# EAGLE design USB to Serial (EAGLE 7.4.0)
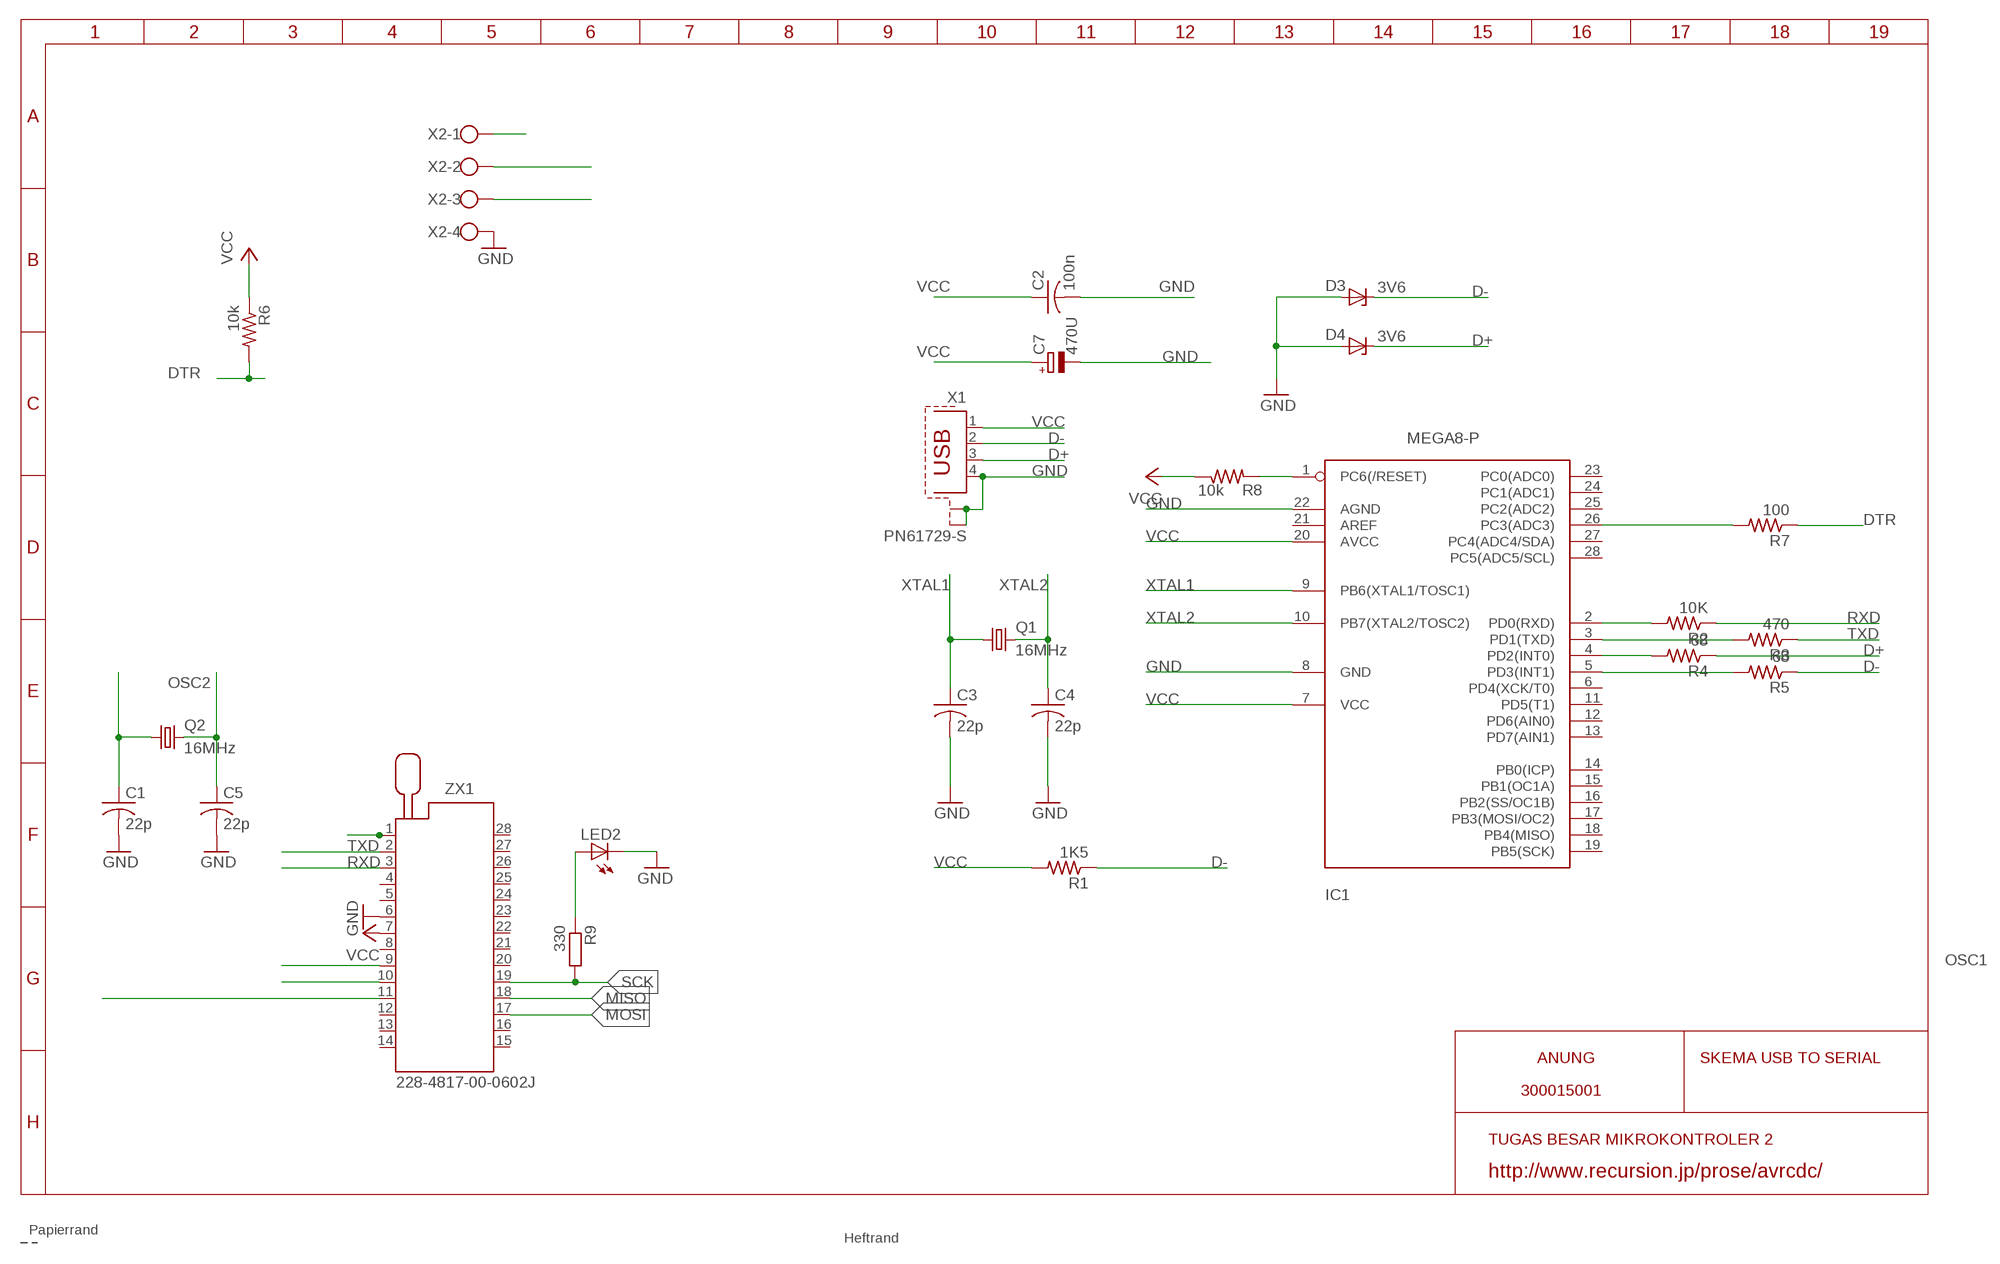
[diagram p0: schematic, sheet 1, part 1 of 2]
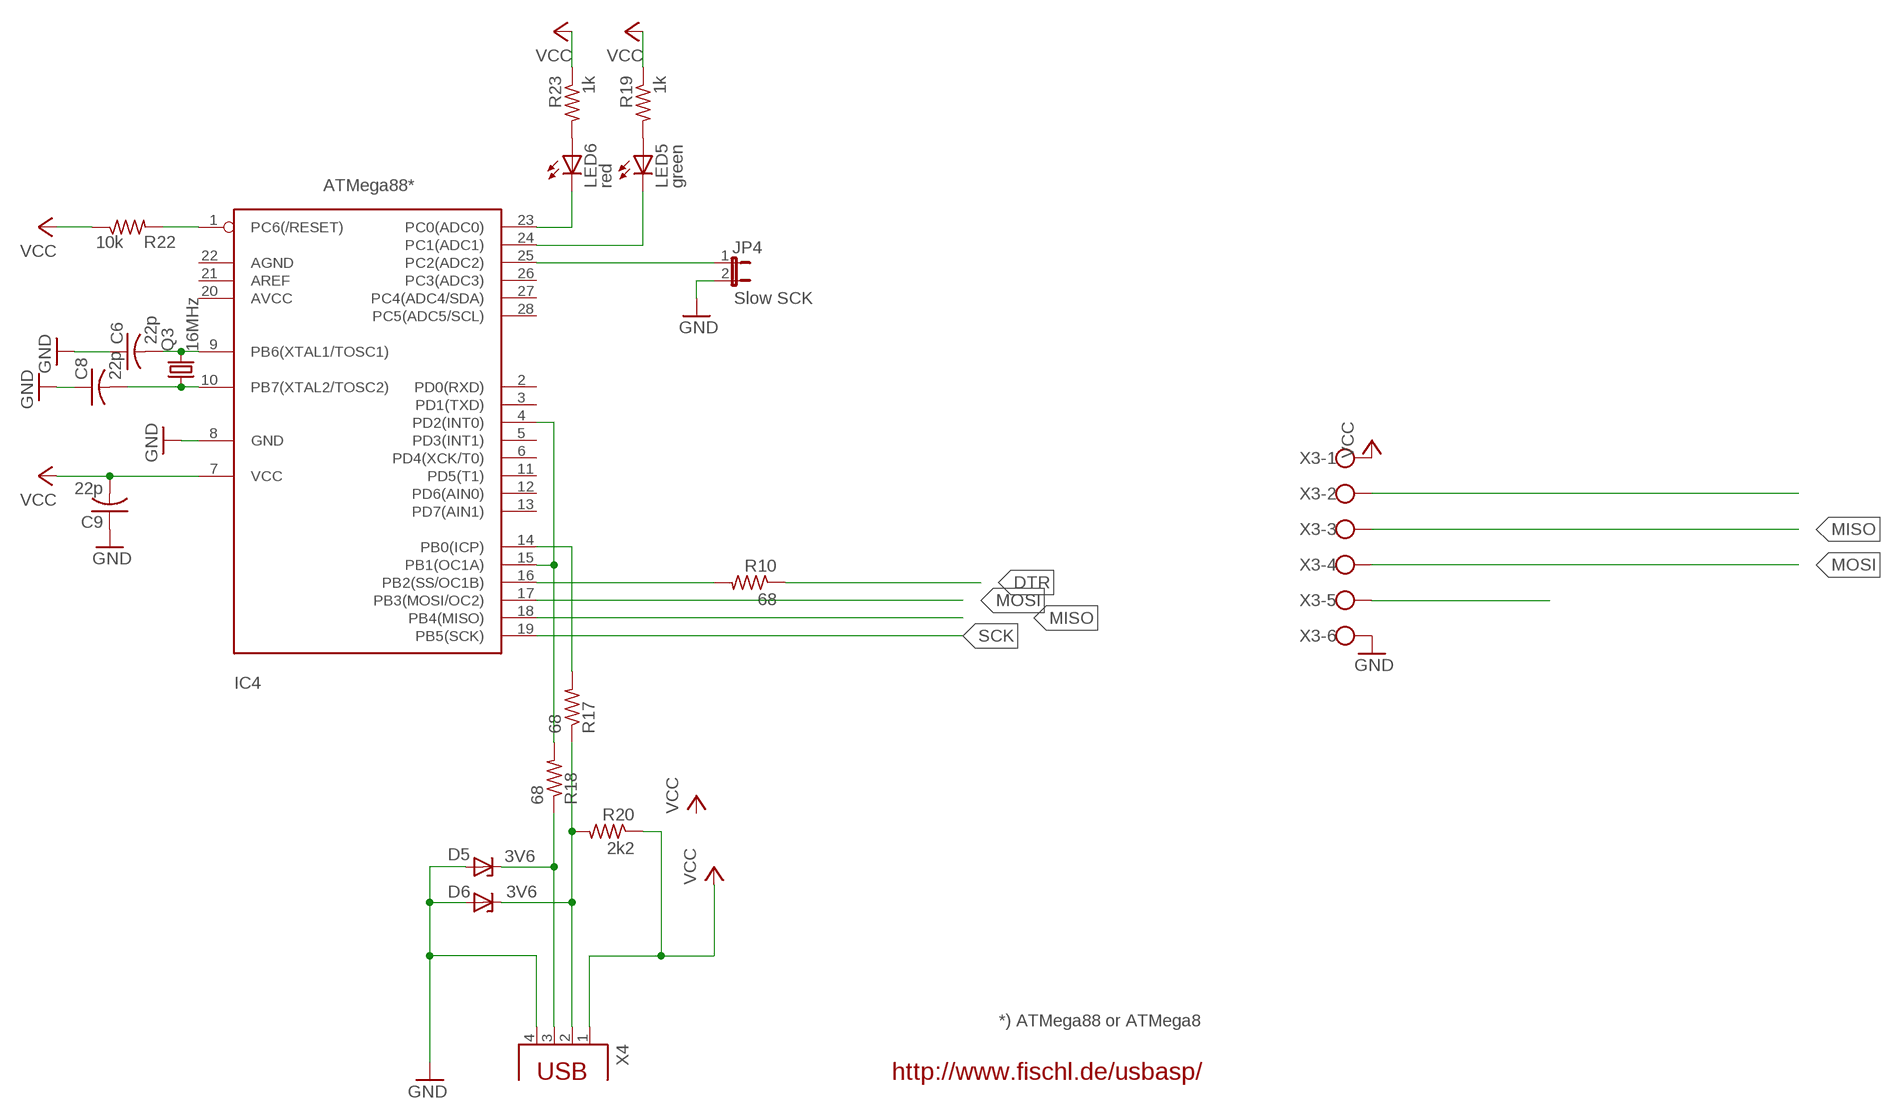
[diagram p1: schematic, sheet 1, part 2 of 2]

## Parts
C1  22p  C-US050-024X044  [C050-024X044]
C2  100n  C-US050-024X044  [C050-024X044]
C3  22p  C-US050-024X044  [C050-024X044]
C4  22p  C-US050-024X044  [C050-024X044]
C5  22p  C-US050-024X044  [C050-024X044]
C6  22p  C-US050-024X044  [C050-024X044]
C7  470U  CPOL-EUE5-5  [E5-5]
C8  22p  C-US050-024X044  [C050-024X044]
C9  22p  C-US050-024X044  [C050-024X044]
D3  3V6  ZENER-DIODEDO34-7  [DO34Z7]
D4  3V6  ZENER-DIODEDO34-7  [DO34Z7]
D5  3V6  ZENER-DIODEDO34-7  [DO34Z7]
D6  3V6  ZENER-DIODEDO34-7  [DO34Z7]
IC1  MEGA8-P  [DIL28-3]
IC4  ATMega88*  MEGA8-P  [DIL28-3]
JP4  Slow SCK  JP1E  [JP1]
LED2  LED5MM  [LED5MM]
LED5  green  LED5MM  [LED5MM]
LED6  red  LED5MM  [LED5MM]
Q1  16MHz  CRYSTALHC49S  [HC49/S]
Q2  16MHz  CRYSTALHC49S  [HC49/S]
Q3  16MHz  CRYSTALHC49S  [HC49/S]
R1  1K5  R-US_0207/7  [0207/7]
R2  10K  R-US_0207/7  [0207/7]
R3  470  R-US_0207/7  [0207/7]
R4  68  R-US_0207/7  [0207/7]
R5  68  R-US_0207/7  [0207/7]
R6  10k  R-US_0207/7  [0207/7]
R7  100  R-US_0207/7  [0207/7]
R8  10k  R-US_0207/10  [0207/10]
R9  330  R-EU_0207/10  [0207/10]
R10  68  R-US_0207/10  [0207/10]
R17  68  R-US_0207/10  [0207/10]
R18  68  R-US_0207/10  [0207/10]
R19  1k  R-US_0207/10  [0207/10]
R20  2k2  R-US_0207/10  [0207/10]
R22  10k  R-US_0207/10  [0207/10]
R23  1k  R-US_0207/10  [0207/10]
X1  PN61729-S  [PN61729-S]
X2  W237-4  [W237-4]
X3  W237-6  [W237-6]
X4  PN61729  [PN61729]
ZX1  228-4817-00-0602J  [228-4817-00-0602J]

## Nets
D+: D4.C R4.1 X1.3
D-: D3.C R1.1 R5.1 X1.2
DTR: R6.2 R7.1 R10.1 X2.1 ZX1.1
GND: C1.2 C2.2 C3.2 C4.2 C5.2 C6.1 C7.- C8.1 C9.1 D3.A D4.A D5.A D6.A IC1.8(GND) IC1.22(AGND) IC4.8(GND) JP4.2 LED2.K(C) X1.4 X1.S1 X1.S2 X2.4 X3.6 X4.4 ZX1.6
MISO: IC4.18(PB4(MISO)) X3.3 ZX1.18
MOSI: IC4.17(PB3(MOSI/OC2)) X3.4 ZX1.17
N$1: IC4.16(PB2(SS/OC1B)) R10.2 X3.5
N$2: IC1.2(PD0(RXD)) R2.2
N$3: IC1.3(PD1(TXD)) R3.2
N$4: IC1.1(PC6(/RESET)) R8.2
N$6: IC1.4(PD2(INT0)) R4.2
N$7: IC1.5(PD3(INT1)) R5.2
N$9: ZX1.11
N$11: IC1.26(PC3(ADC3)) R7.2
N$16: LED2.A R9.1
N$33: D6.C R17.1 R20.2 X4.2
N$34: D5.C R18.1 X4.3
N$35: C6.2 IC4.9(PB6(XTAL1/TOSC1)) Q3.2
N$36: C8.2 IC4.10(PB7(XTAL2/TOSC2)) Q3.1
N$37: LED5.A R19.2
N$38: IC4.4(PD2(INT0)) IC4.15(PB1(OC1A)) R18.2
N$39: IC4.1(PC6(/RESET)) R22.2
N$47: IC4.25(PC2(ADC2)) JP4.1
N$48: LED6.A R23.2
N$49: IC4.23(PC0(ADC0)) LED6.K(C)
N$50: IC4.24(PC1(ADC1)) LED5.K(C)
N$51: IC4.14(PB0(ICP)) R17.2
OSC1: C1.1 Q2.1 ZX1.9
OSC2: C5.1 Q2.2 ZX1.10
RXD: R2.1 X2.3 ZX1.3
SCK: IC4.19(PB5(SCK)) R9.2 X3.2 ZX1.19
TXD: R3.1 X2.2 ZX1.2
VCC: C2.1 C7.+ C9.2 IC1.7(VCC) IC1.20(AVCC) IC4.7(VCC) R1.2 R6.1 R8.1 R19.1 R20.1 R22.1 R23.1 X1.1 X3.1 X4.1 ZX1.7
XTAL1: C3.1 IC1.9(PB6(XTAL1/TOSC1)) Q1.1
XTAL2: C4.1 IC1.10(PB7(XTAL2/TOSC2)) Q1.2
Unconnected: IC1.6(PD4(XCK/T0)) IC1.11(PD5(T1)) IC1.12(PD6(AIN0)) IC1.13(PD7(AIN1)) IC1.14(PB0(ICP)) IC1.15(PB1(OC1A)) IC1.16(PB2(SS/OC1B)) IC1.17(PB3(MOSI/OC2)) IC1.18(PB4(MISO)) IC1.19(PB5(SCK)) IC1.21(AREF) IC1.23(PC0(ADC0)) IC1.24(PC1(ADC1)) IC1.25(PC2(ADC2)) IC1.27(PC4(ADC4/SDA)) IC1.28(PC5(ADC5/SCL)) IC4.2(PD0(RXD)) IC4.3(PD1(TXD)) IC4.5(PD3(INT1)) IC4.6(PD4(XCK/T0)) IC4.11(PD5(T1)) IC4.12(PD6(AIN0)) IC4.13(PD7(AIN1)) IC4.20(AVCC) IC4.21(AREF) IC4.22(AGND) IC4.26(PC3(ADC3)) IC4.27(PC4(ADC4/SDA)) IC4.28(PC5(ADC5/SCL)) ZX1.4 ZX1.5 ZX1.8 ZX1.12 ZX1.13 ZX1.14 ZX1.15 ZX1.16 ZX1.20 ZX1.21 ZX1.22 ZX1.23 ZX1.24 ZX1.25 ZX1.26 ZX1.27 ZX1.28

## Notes on the sheet
- *) ATMega88 or ATMega8
- ANUNG | SKEMA USB TO SERIAL
- 300015001 | http://www.fischl.de/usbasp/
- TUGAS BESAR MIKROKONTROLER 2
- http://www.recursion.jp/prose/avrcdc/

## Library data of the parts
C1-C6 C8 C9 = adafruit:C-US: CAPACITOR, American symbol
C7 = rcl:CPOL-EU: POLARIZED CAPACITOR, European symbol
D3-D6 = diode:ZENER-DIODE: Z-Diode
IC1 IC4 = atmel:MEGA8-P: MICROCONTROLLER 8 Kbytes FLASH 1 kbytes SRAM 512 bytes EEPROM USART 4-channel 10 bit ADC 2-channel 8 bit ADC Source: avr.lbr
JP4 = jumper:JP1E: JUMPER
LED2 LED5 LED6 = led:LED: LED OSRAM: - CHIPLED LG R971, LG N971, LY N971, LG Q971, LY Q971, LO R971, LY R971 LH N974, LH R974 LS Q976, LO Q976, LY Q976 LO Q996 - Hyper CHIPLED LW Q18S LB Q993, LB Q99A, LB R99A - SideLED LS A670, LO A670, LY A670, LG A670, LP A670 LB A673, LV A673, LT A673, LW A673 LH A674 LY A675 LS A676, LA A676, LO A676, LY A676, LW A676 LS A679, LY A679, LG A679 - Hyper Micro SIDELED® LS Y876, LA Y876, LO Y876, LY Y876 LT Y87S - SmartLED LW L88C, LW L88S LB L89C, LB L89S, LG L890 LS L89K, LO L89K, LY L89K LS L896, LA L896, LO L896, LY L896 - TOPLED LS T670, LO T670, LY T670, LG T670, LP T670 LSG T670, LSP T670, LSY T670, LOP T670, LYG T670 LG T671, LOG T671, LSG T671 LB T673, LV T673, LT T673, LW T673 LH T674 LS T676, LA T676, LO T676, LY T676, LB T676, LH T676, LSB T676, LW T676 LB T67C, LV T67C, LT T67C, LS T67K, LO T67K, LY T67K, LW E67C LS E67B, LA E67B, LO E67B, LY E67B, LB E67C, LV E67C, LT E67C LW T67C LS T679, LY T679, LG T679 LS T770, LO T770, LY T770, LG T770, LP T770 LB T773, LV T773, LT T773, LW T773 LH T774 LS E675, LA E675, LY E675, LS T675 LS T776, LA T776, LO T776, LY T776, LB T776 LHGB T686 LT T68C, LB T68C - Hyper Mini TOPLED® LB M676 - Mini TOPLED Santana® LG M470 LS M47K, LO M47K, LY M47K Source: http://www.osram.convergy.de LUXEON: - LUMILED® LXK2-PW12-R00, LXK2-PW12-S00, LXK2-PW14-U00, LXK2-PW14-V00 LXK2-PM12-R00, LXK2-PM12-S00, LXK2-PM14-U00 LXK2-PE12-Q00, LXK2-PE12-R00, LXK2-PE12-S00, LXK2-PE14-T00, LXK2-PE14-U00 LXK2-PB12-K00, LXK2-PB12-L00, LXK2-PB12-M00, LXK2-PB14-N00, LXK2-PB14-P00, LXK2-PB14-Q00 LXK2-PR12-L00, LXK2-PR12-M00, LXK2-PR14-Q00, LXK2-PR14-R00 LXK2-PD12-Q00, LXK2-PD12-R00, LXK2-PD12-S00 LXK2-PH12-R00, LXK2-PH12-S00 LXK2-PL12-P00, LXK2-PL12-Q00, LXK2-PL12-R00 Source: www.luxeon.com KINGBRIGHT: KA-3528ASYC Source: www.kingbright.com
Q1-Q3 = adafruit:CRYSTAL: CRYSTAL; OC_FARNELL: 1667008; OC_NEWARK: unknown
R1-R7 = adafruit:R-US_: RESISTOR, American symbol
R8 R10 R17-R20 R22 R23 = rcl:R-US_: RESISTOR, American symbol
R9 = rcl:R-EU_: RESISTOR, European symbol
X1 = con-berg:PN61729-S: BERG USB connector; OC_FARNELL: unknown; OC_NEWARK: unknown
X2 = con-wago-500:W237-4: WAGO SCREW CLAMP; OC_FARNELL: unknown; OC_NEWARK: unknown
X3 = con-wago-500:W237-6: WAGO SCREW CLAMP; OC_FARNELL: unknown; OC_NEWARK: unknown
X4 = con-berg:PN61729: BERG USB connector
ZX1 = con-3m:228-?00-0602J: Zero Insertion Force Socked Source: http://www.3M.com/ehpd; MF: 3M; MPN: 228-4817-00-0602J; OC_FARNELL: 1252775; OC_NEWARK: 85K7834

## Board
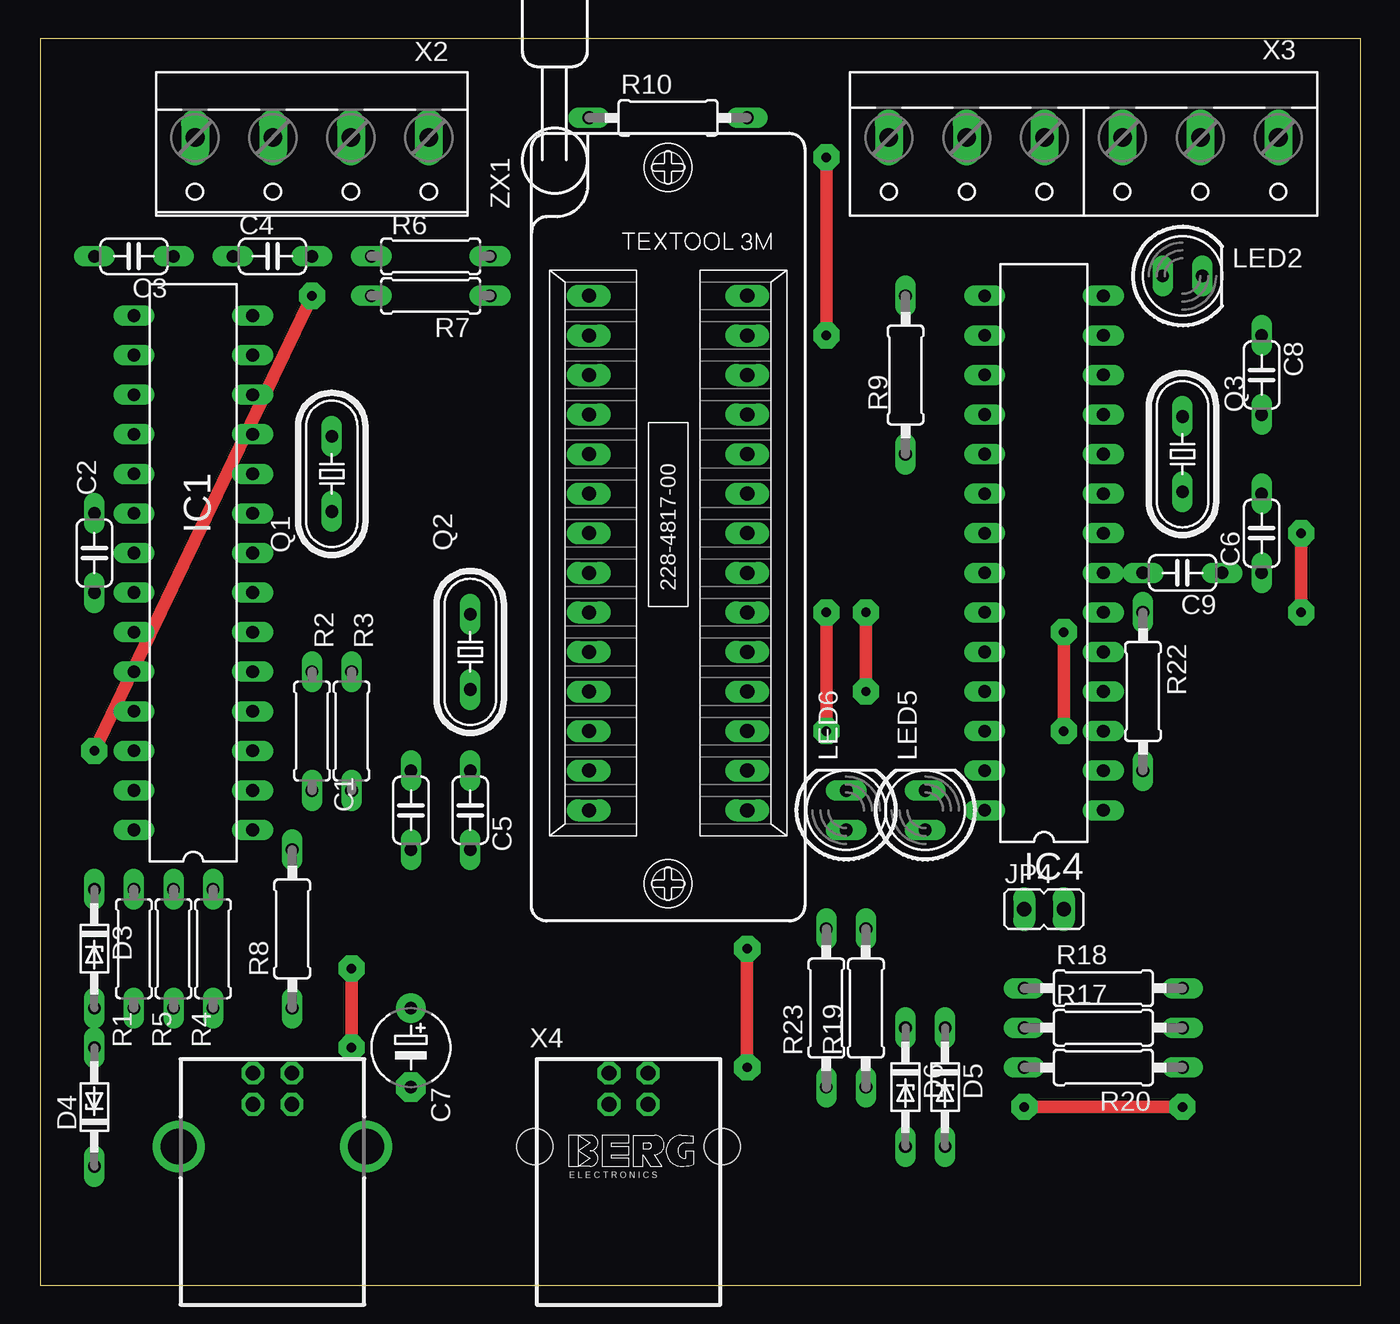
[diagram p2: board, top side]
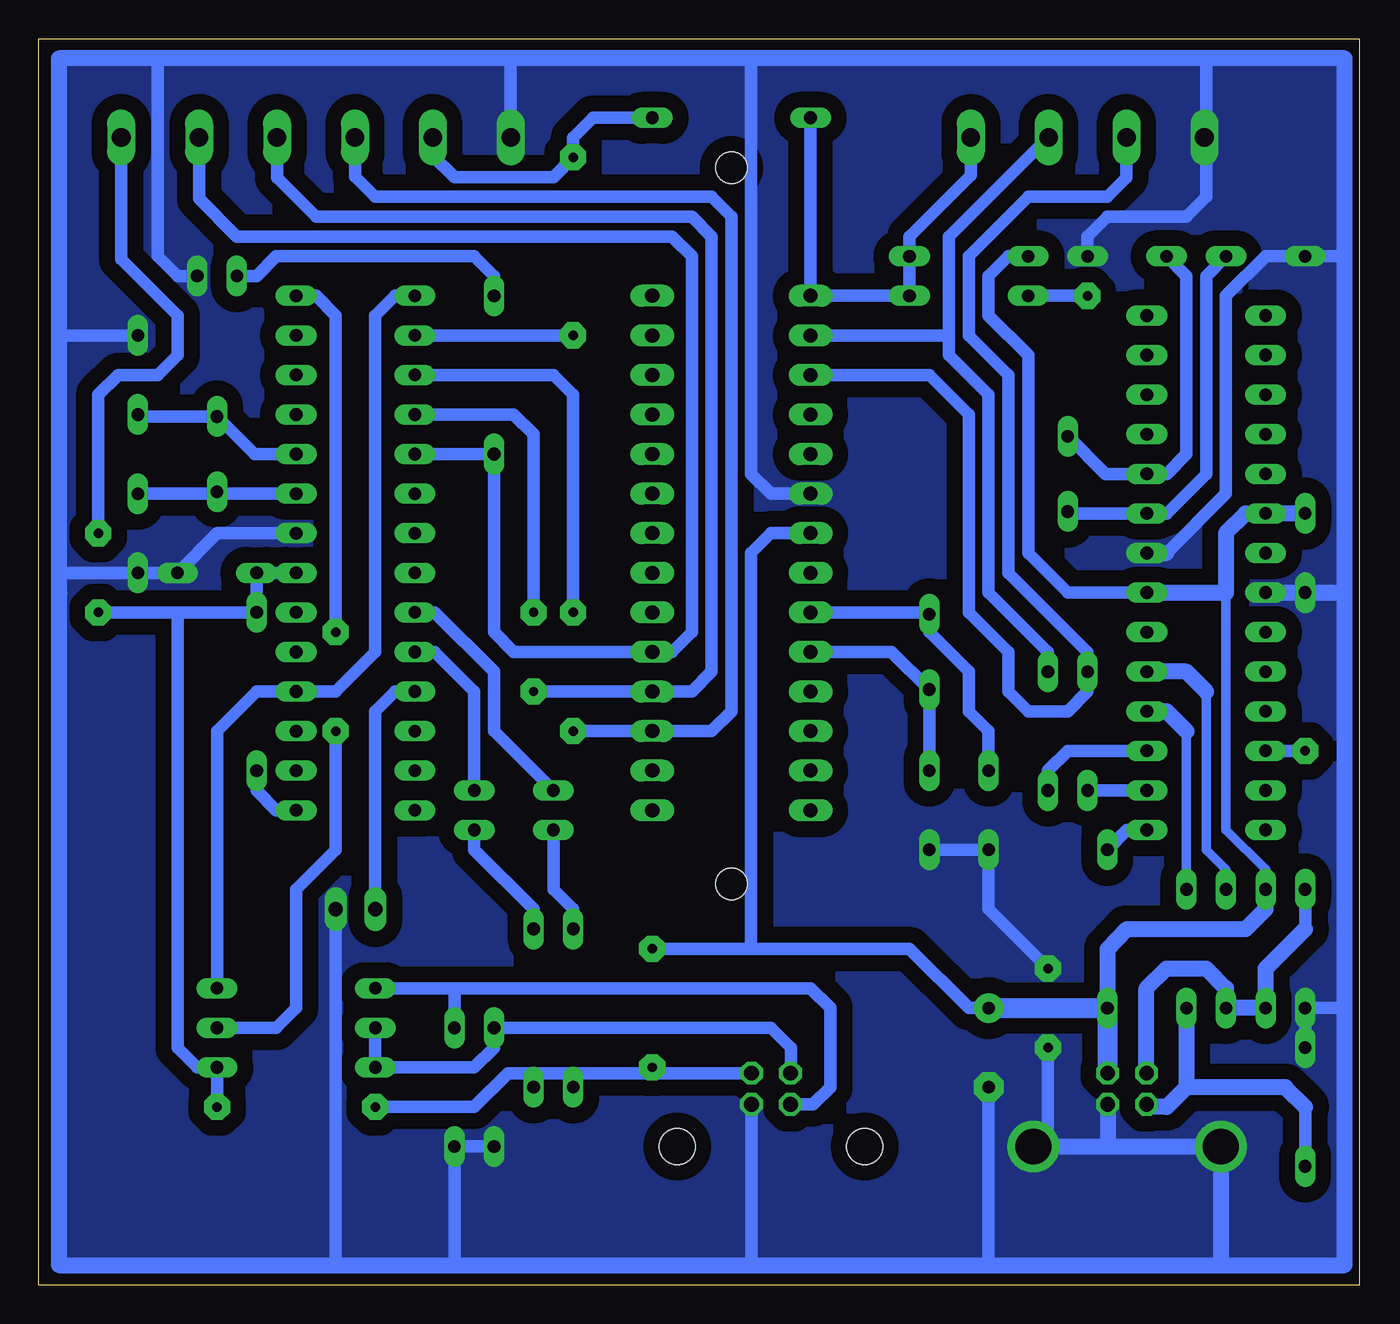
[diagram p3: board, bottom side, seen from below]

Size 84.76 x 79.99 mm. Coordinates in mm from the lower left corner, seen from the top.
Outline: 84.76,0 84.76,79.99 0,79.99 0,0 84.76,0
Copper layers (1*16): Top 0.035mm / dielectric 1.5mm / Bottom 0.035mm
Design rules "default": minimum track width 10mil, minimum drill 24mil, track to track 8mil, track to pad 8mil, pad to pad 8mil, via to via 8mil, smd to smd 8mil, copper to edge 40mil, drill to drill 8mil, minimum pad ring 10mil, minimum via ring 8mil, stop-mask expansion 4mil, vias tented up to drill 0mil, thermal gap 10mil

### Footprints (pad centres in the part's own frame; a part is rotated, then mirrored left to right if it is on the bottom)
C050-024X044 = drill 0.813 long: 1 -2.54,0; 2 2.54,0
E5-5 = drill 0.813 pad 1.905: + -2.54,0 | drill 0.813 pad 1.905 octagon: - 2.54,0
DO34Z7 = drill 0.813 long: A 3.81,0; C -3.81,0
DIL28-3 = drill 0.813 long: 1 -16.51,-3.81; 2 -13.97,-3.81; 3 -11.43,-3.81; 4 -8.89,-3.81; 5 -6.35,-3.81; 6 -3.81,-3.81; 7 -1.27,-3.81; 8 1.27,-3.81; 9 3.81,-3.81; 10 6.35,-3.81; 11 8.89,-3.81; 12 11.43,-3.81; 13 13.97,-3.81; 14 16.51,-3.81; 15 16.51,3.81; 16 13.97,3.81; 17 11.43,3.81; 18 8.89,3.81; 19 6.35,3.81; 20 3.81,3.81; 21 1.27,3.81; 22 -1.27,3.81; 23 -3.81,3.81; 24 -6.35,3.81; 25 -8.89,3.81; 26 -11.43,3.81; 27 -13.97,3.81; 28 -16.51,3.81
JP1 = drill 0.914 long: 1 0,-1.27; 2 0,1.27
LED5MM = drill 0.813 long: A -1.27,0; K 1.27,0
HC49/S = drill 0.813 long: 1 -2.413,0; 2 2.413,0
0207/7 = drill 0.813 long: 1 -3.81,0; 2 3.81,0
0207/10 = drill 0.813 long: 1 -5.08,0; 2 5.08,0
PN61729-S = drill 0.95 octagon: 1 1.25,4.71; 2 -1.25,4.71; 3 -1.25,2.71; 4 1.25,2.71 | drill 2.3 pad 2.9: S1 -6.02,0; S2 6.02,0
W237-4 = drill 1.194 long: 1 -7.5,-1.27; 2 -2.5,-1.27; 3 2.5,-1.27; 4 7.5,-1.27
W237-6 = drill 1.194 long: 1 -12.5,-1.27; 2 -7.5,-1.27; 3 -2.5,-1.27; 4 2.5,-1.27; 5 7.5,-1.27; 6 12.5,-1.27
PN61729 = drill 0.95 octagon: 1 1.25,4.71; 2 -1.25,4.71; 3 -1.25,2.71; 4 1.25,2.71 | hole 2.3: -6.02,0; 6.02,0
228-4817-00-0602J = drill 0.9 long: 1 -16.51,-5.08; 2 -13.97,-5.08; 3 -11.43,-5.08; 4 -8.89,-5.08; 5 -6.35,-5.08; 6 -3.81,-5.08; 7 -1.27,-5.08; 8 1.27,-5.08; 9 3.81,-5.08; 10 6.35,-5.08; 11 8.89,-5.08; 12 11.43,-5.08; 13 13.97,-5.08; 14 16.51,-5.08; 15 16.51,5.08; 16 13.97,5.08; 17 11.43,5.08; 18 8.89,5.08; 19 6.35,5.08; 20 3.81,5.08; 21 1.27,5.08; 22 -1.27,5.08; 23 -3.81,5.08; 24 -6.35,5.08; 25 -8.89,5.08; 26 -11.43,5.08; 27 -13.97,5.08; 28 -16.51,5.08 | hole 2: 21.24,0; -24.74,0

### Placement (x,y rotation side)
C1  23.8,30.48 270 top
C2  3.48,46.99 270 top
C3  6.02,66.04 180 top
C4  14.91,66.04 0 top
C5  27.61,30.48 270 top
C6  78.41,48.26 90 top
C7  23.8,15.24 270 top
C8  78.41,58.42 270 top
C9  73.33,45.72 180 top
D3  3.48,21.59 270 top
D4  3.48,11.43 90 top
D5  58.09,12.7 270 top
D6  55.55,12.7 270 top
IC1  9.83,45.72 90 top
IC4  64.44,46.99 90 top
JP4  64.44,24.13 270 top
LED2  73.33,64.77 0 top
LED5  56.82,30.48 90 top
LED6  51.74,30.48 90 top
Q1  18.72,52.07 90 top
Q2  27.61,40.64 270 top
Q3  73.33,53.34 270 top
R1  6.02,21.59 90 top
R2  17.45,35.56 270 top
R3  19.99,35.56 270 top
R4  11.1,21.59 90 top
R5  8.56,21.59 90 top
R6  25.07,66.04 0 top
R7  25.07,63.5 180 top
R8  16.18,22.86 90 top
R9  55.55,58.42 270 top
R10  40.31,74.93 0 top
R17  68.25,16.51 0 top
R18  68.25,19.05 0 top
R19  53.01,17.78 90 top
R20  68.25,13.97 180 top
R22  70.79,38.1 270 top
R23  50.47,17.78 90 top
X1  14.91,8.89 0 top
X2  17.45,72.39 180 top
X3  66.98,72.39 180 top
X4  37.77,8.89 0 top
ZX1  40.31,46.99 270 top

### Tracks (layer width: path | path; a pad name or v marks a point on that pad's centre or on a via)
D+
  Bottom 0.813: D4.C 3.48,11.43
  Bottom 1.016: 3.48,11.43 4.75,12.7 11.1,12.7 | 11.1,12.7 12.37,11.43 13.49,11.43 X1.3 | R4.1 11.1,12.7
D-
  Bottom 0.813: D3.C 3.48,22.86
  Bottom 1.016: X1.2 13.66,19.03 12.37,20.32 9.83,20.32 8.56,19.05 R5.1 R1.1 6.02,20.32 3.48,22.86
DTR
  Bottom 0.813: X2.1 24.95,71.24 28.88,67.31 R6.2 R7.1 ZX1.1 R10.1
GND  (via drill 0.6 pad 1.68)
  Top 0.813: v19.99,20.32 v19.99,15.24
  Bottom 0.813: 12.37,46.99 8.56,50.8 8.56,63.5 6.02,66.04 C3.2 0.94,66.04 | C4.2 17.45,67.31 16.18,68.58 11.1,68.58 9.83,69.85 9.83,78.74 | C7.- 23.8,1.27 | 58.09,1.27 D5.A D6.A | X4.4 39.02,1.29 39.04,1.27 | 83.49,45.72 C6.1 C9.1 73.33,48.26 IC4.8 | C8.1 83.49,60.96 | 0.94,17.78 D3.A D4.A | JP4.2 65.71,1.27 | C5.2 C1.2 23.8,24.13 v19.99,20.32 | v19.99,15.24 19.99,9.83 X1.S2 | ZX1.6 37.77,50.8 39.04,52.07 39.04,78.74 | X3.6 54.48,78.54 54.28,78.74 | LED2.K 75.87,64.77 77.14,66.04 77.14,78.74
  Bottom 1.016: 8.56,1.27 8.89,1.6 X1.S1 16.18,8.89 | 8.56,1.27 0.94,1.27 0.94,17.78 0.94,44.45 | 0.94,44.45 0.94,66.04 0.94,78.74 9.83,78.74 39.04,78.74 54.28,78.74 77.14,78.74 83.49,78.74 83.49,60.96 83.49,45.72 83.49,44.45 | IC1.22 C2.2 0.94,44.45 | IC1.8 12.37,46.99 | X1.S2 16.18,8.89 | X1.4 16.16,8.91 16.18,8.89 | 83.49,44.45 83.49,1.27 65.71,1.27 58.09,1.27 39.04,1.27 23.8,1.27 8.56,1.27 | 83.45,44.41 83.49,44.45
  pour Bottom (isolate 1.016, no thermals): 84.76,0 84.76,80.01 -0.33,80.01 -0.33,0
MISO  (via drill 0.6 pad 1.68)
  Top 0.813: v53.01,38.1 v53.01,43.18
  Bottom 0.813: v53.01,43.18 53.01,54.61 54.28,55.88 IC4.18 | v53.01,38.1 ZX1.18 42.85,38.1 41.58,39.37 41.58,67.31 42.85,68.58 66.98,68.58 69.48,71.08 X3.3
MOSI  (via drill 0.6 pad 1.68)
  Top 0.813: v50.47,43.18 v50.47,35.56
  Bottom 0.813: IC4.17 51.74,58.42 50.47,57.15 v50.47,43.18 | v50.47,35.56 ZX1.17 41.58,35.56 40.31,36.83 40.31,68.58 41.58,69.85 63.17,69.85 64.48,71.16 X3.4
N$1  (via drill 0.6 pad 1.68)
  Top 0.813: v50.47,72.39 v50.47,60.96
  Bottom 0.813: X3.5 59.48,72.51 58.09,71.12 51.74,71.12 v50.47,72.39 50.47,73.66 49.2,74.93 R10.2 | v50.47,60.96 IC4.16
N$2
  Bottom 0.813: R2.2 IC1.2
N$3
  Bottom 0.813: IC1.3 18.72,34.29 19.99,33.02 R3.2
N$4
  Bottom 0.813: IC1.1 14.91,29.21 R8.2
N$6
  Bottom 0.61: 11.1,35.56 R4.2
  Bottom 1.016: 11.1,35.56 12.37,36.83 IC1.4
N$7
  Bottom 0.61: 9.83,38.1 9.83,27.94 8.56,26.67 R5.2
  Bottom 1.016: 9.83,38.1 11.1,39.37 IC1.5
N$11  (via drill 0.6 pad 1.68)
  Top 0.813: v3.48,34.29 v17.45,63.5
  Bottom 0.813: R7.2 v17.45,63.5 | IC1.26 v3.48,34.29
N$16
  Bottom 0.813: LED2.A 70.79,64.77 69.52,66.04 56.82,66.04 55.55,64.77 R9.1
N$33
  Bottom 0.813: X4.2 36.5,13.6 36.5,15.24 37.77,16.51 D6.C 55.55,15.24 56.82,13.97 R20.2 R17.1
N$34
  Bottom 0.813: X4.3 35.06,11.6 33.96,12.7 33.96,17.78 35.23,19.05 R18.1 58.09,19.05 D5.C
N$35
  Bottom 0.813: IC4.9 73.2,50.8 Q3.2 73.46,50.8 C6.2
N$36
  Bottom 0.813: IC4.10 70.92,53.34 Q3.1 78.28,55.75 C8.2
N$37
  Bottom 0.813: LED5.A 56.82,27.94 53.01,24.13 R19.2
N$38
  Bottom 0.813: IC4.15 61.9,63.5 63.17,62.23 63.17,40.64 65.71,38.1 IC4.4 70.79,38.1 73.33,35.56 R18.2
N$39
  Bottom 0.813: IC4.1 69.52,30.48 70.79,31.75 R22.2
N$47
  Bottom 0.813: IC4.25 61.9,38.1 63.17,36.83 JP4.1
N$48
  Bottom 0.813: LED6.A 51.74,25.4 50.47,24.13 R23.2
N$49
  Bottom 0.813: IC4.23 59.36,43.18 55.55,39.37 55.55,35.56 LED6.K
N$50
  Bottom 0.813: IC4.24 59.36,40.64 56.82,38.1 LED5.K
N$51  (via drill 0.6 pad 1.68)
  Top 0.813: v65.71,41.91 v65.71,35.56
  Bottom 0.813: IC4.14 66.98,63.5 65.71,62.23 v65.71,41.91 | v65.71,35.56 65.71,27.94 68.25,25.4 68.25,17.78 69.52,16.51 R17.2
OSC1
  Bottom 0.813: C1.1 23.8,35.56 25.07,36.83 25.07,39.37 27.61,41.91 Q2.1 27.74,43.18 ZX1.9
OSC2
  Bottom 0.813: C5.1 Q2.2 30.02,40.64 ZX1.10
RXD
  Bottom 0.813: X2.3 14.95,71.08 16.18,69.85 21.26,69.85 25.07,66.04 25.07,60.96 22.53,58.42 22.53,45.72 17.45,40.64 R2.1 17.45,38.1 18.72,36.83 21.26,36.83 22.53,38.1 22.53,40.64 25.07,43.18 25.07,55.88 27.61,58.42 ZX1.3
SCK
  Bottom 0.813: X3.2 74.48,69.73 72.06,67.31 44.12,67.31 42.85,66.04 42.85,41.91 44.12,40.64 ZX1.19 54.28,40.64 55.55,41.91 R9.2 IC4.19
TXD
  Bottom 0.813: R3.1 19.99,40.64 23.8,44.45 23.8,57.15 26.34,59.69 | X2.2 19.99,73.66 26.34,67.31 26.34,59.69 | ZX1.2 26.34,60.96 26.34,59.69
VCC  (via drill 0.6 pad 1.68)
  Top 0.813: v45.39,21.59 v45.39,13.97 | v80.95,48.26 v80.95,43.18 | v63.17,11.43 v73.33,11.43
  Bottom 0.61: 8.56,44.45 8.56,29.21 6.02,26.67 R1.2
  Bottom 0.813: R6.1 22.53,66.04 23.8,64.77 23.8,62.23 21.26,59.69 21.26,46.99 18.72,44.45 IC1.7 | 39.04,21.59 39.04,46.99 37.77,48.26 ZX1.7 | 39.04,21.59 28.88,21.59 25.07,17.78 C7.+ | IC4.7 C9.2 R22.1 75.87,43.18 | X4.1 45.39,13.6 | 45.39,13.6 50.47,13.6 | 50.47,13.6 53.01,13.6 | 53.01,13.6 54.65,13.6 56.82,11.43 v63.17,11.43 | 39.04,21.59 v45.39,21.59 | v45.39,13.97 45.39,13.6 | R19.1 53.01,13.6 | R23.1 50.47,13.6 | X3.1 79.48,65.84 75.87,62.23 75.87,59.69 77.14,58.42 79.68,58.42 80.95,57.15 v80.95,48.26 | v80.95,43.18 75.87,43.18 | 75.87,43.18 75.87,15.24 74.6,13.97 R20.1 v73.33,11.43 | R8.1 16.18,13.62 X1.1
  Bottom 1.016: C2.1 IC1.20 7.29,49.53 8.56,48.26 8.56,44.45 IC1.7 | R1.2 6.02,24.13 7.29,22.86 14.91,22.86 16.16,21.57 16.16,17.78
  Bottom 1.27: C7.+ R8.1 16.16,17.78 X1.1
XTAL1
  Bottom 0.813: C3.1 9.83,64.77 9.83,52.07 12.37,49.53 IC1.9 18.59,49.53 Q1.1
XTAL2
  Bottom 0.813: C4.1 11.1,64.77 11.1,53.34 12.37,52.07 IC1.10 16.31,52.07 Q1.2